# Altium project OpenChill.PrjPcb
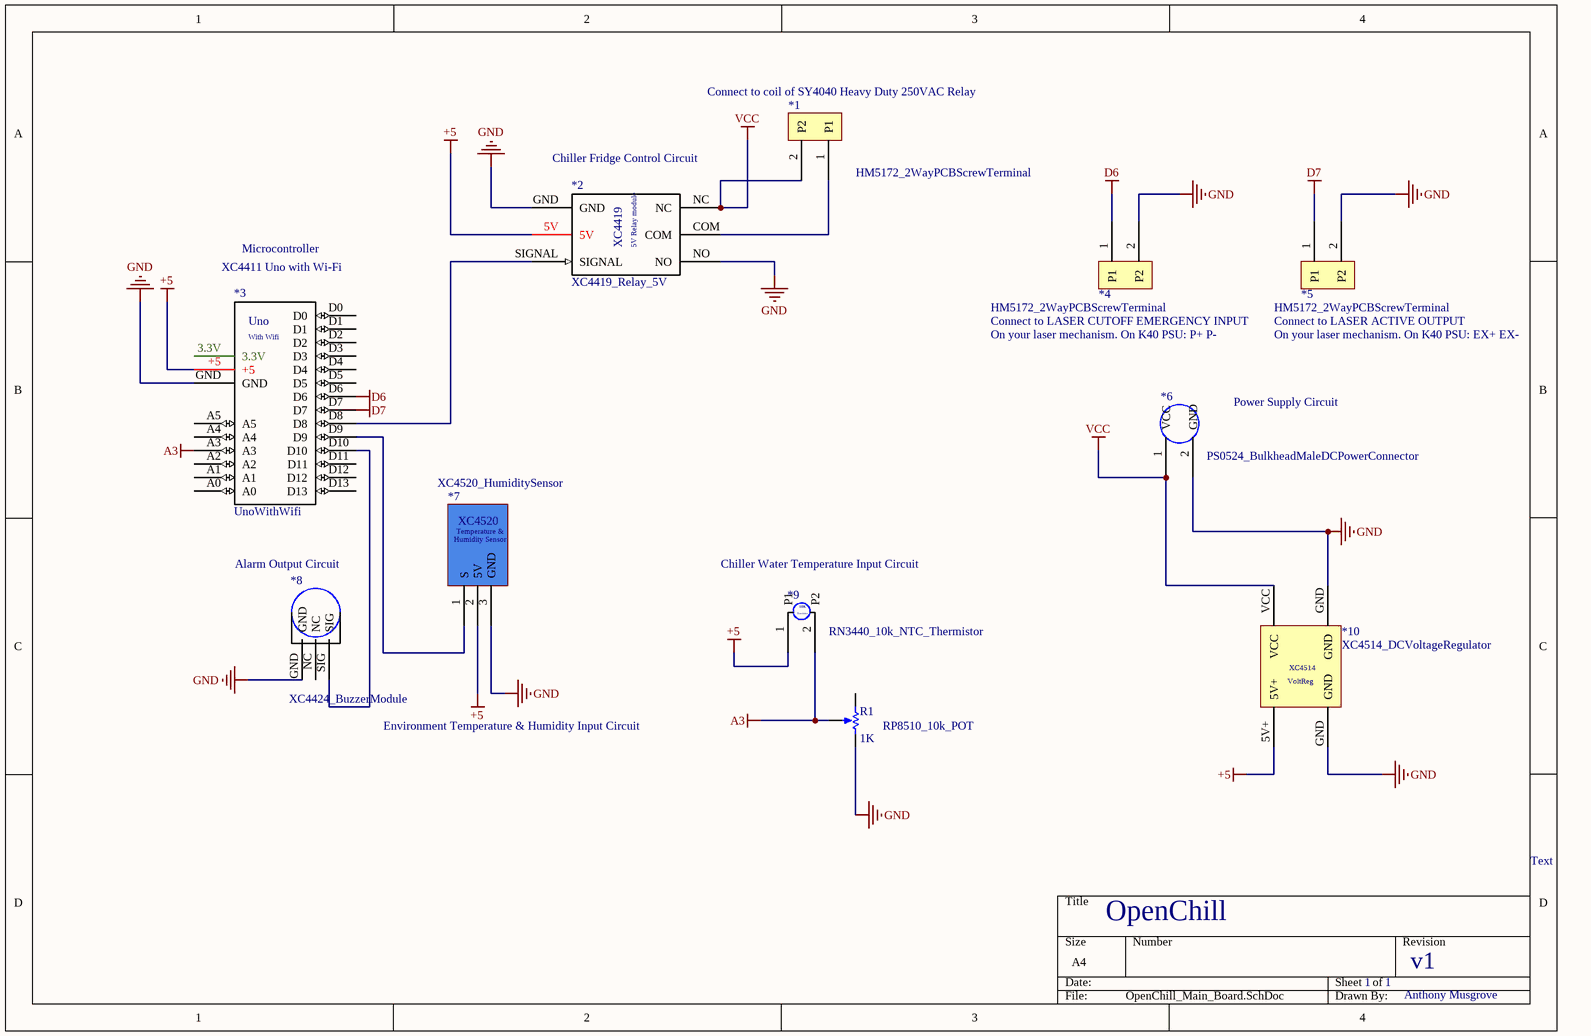
[diagram p0: OpenChill_Main_Board.SchDoc]
1 sheet, 11 parts. Net scope: global (net labels, ports and power ports of the same name join across sheets).
Board file: OpenChill_PCB_01.PcbDoc

## Sheet OpenChill_Main_Board.SchDoc
size A4

### Parts
*1  HM5172_2WayPCBScrewTerminal  [OpenChill_2xThruHole]
*2  XC4419_Relay_5V  [XC4419_5VRelay_Footprint]
*3  UnoWithWifi  [ARDUINO_INTERFACE_FOOTPRINT]
*4  HM5172_2WayPCBScrewTerminal  [OpenChill_2xThruHole]
*5  HM5172_2WayPCBScrewTerminal  [OpenChill_2xThruHole]
*6  PS0524_BulkheadMaleDCPowerConnector  [OpenChill_2xThruHole]
*7  XC4520_HumiditySensor  [OpenChill_3xThruHole]
*8  XC4424_BuzzerModule  [XC4424_BuzzerModule_Footprint]
*9  RN3440_10k_NTC_Thermistor  [OpenChill_2xThruHole]
*10  XC4514_DCVoltageRegulator  [XC4514_VoltReg_Footprint]
R1  RP8510_10k_POT  value 1K  [VR5]

### Nets
+5: *2.5V *3.+5 *7.2(5V) *9.1(P1) *10.5V+
A3: *3.A3 *9.2(P2) R1.3(TAP)
D6: *3.D6 *4.1(P1)
D7: *3.D7 *5.1(P1)
GND: *2.GND *2.NO *3.GND *4.2(P2) *5.2(P2) *6.2(GND) *7.3(GND) *8.GND *10.GND R1.2(BOT)
VCC: *1.2(P2) *2.NC *6.1(VCC) *10.VCC
Net*1_1: *1.1(P1) *2.COM
Net*2_SIGNAL: *2.SIGNAL *3.D8
Net*3_D9: *3.D9 *7.1(S)
Net*3_D10: *3.D10 *8.SIG

Not connected (* = marked no-connect by the designer): *3 3.3V A0 A1 A2 A4 A5 D0 D1 D2 D3 D4 D5 D11 D12 D13; *8 NC; R1 1(TOP)

### Notes on the sheet
- (near *1) Connect to coil of SY4040 Heavy Duty 250VAC Relay
- (near *2) Chiller Fridge Control Circuit
- (near *3) XC4411 Uno with Wi-Fi
- Microcontroller
- Connect to LASER CUTOFF EMERGENCY INPUT
- On your laser mechanism. On K40 PSU: P+ P-
- Connect to LASER ACTIVE OUTPUT
- On your laser mechanism. On K40 PSU: EX+ EX-
- (near *6) Power Supply Circuit
- Alarm Output Circuit
- (near *9) Chiller Water Temperature Input Circuit
- Environment Temperature & Humidity Input Circuit
- OpenChill
- Text
- 1
- v1
- Anthony Musgrove
- (in symbol RN3440_10k_NTC_Thermistor) 10K; Thermistor
- (in symbol UnoWithWifi) Uno; With Wifi
- (in symbol XC4419_Relay_5V) XC4419; 5V Relay module
- (in symbol XC4514_DCVoltageRegulator) XC4514; VoltReg
- (in symbol XC4520_HumiditySensor) XC4520; Temperature &; Humidity Sensor

### Library data of the parts
*4 = HM5172_2WayPCBScrewTerminal: LASER CUTOFF EMERGENCY
*5 = HM5172_2WayPCBScrewTerminal: LASER ACTIVE
R1 = RPot: Potentiometer; Sim Note: Enter the Resistance value and the set point into parameter fields.; Set Position: 0.5; Published: 8-Jun-2000; LatestRevisionDate: 17-Jul-2002; LatestRevisionNote: Re-released for DXP Platform.; PackageReference: VR5; Publisher: Altium Limited; PackageDescription: Variable Resistor, Thru-Hole; 3 Leads